# EAGLE design Qwiic_Shield_for_Teensy (EAGLE 9.6.2)
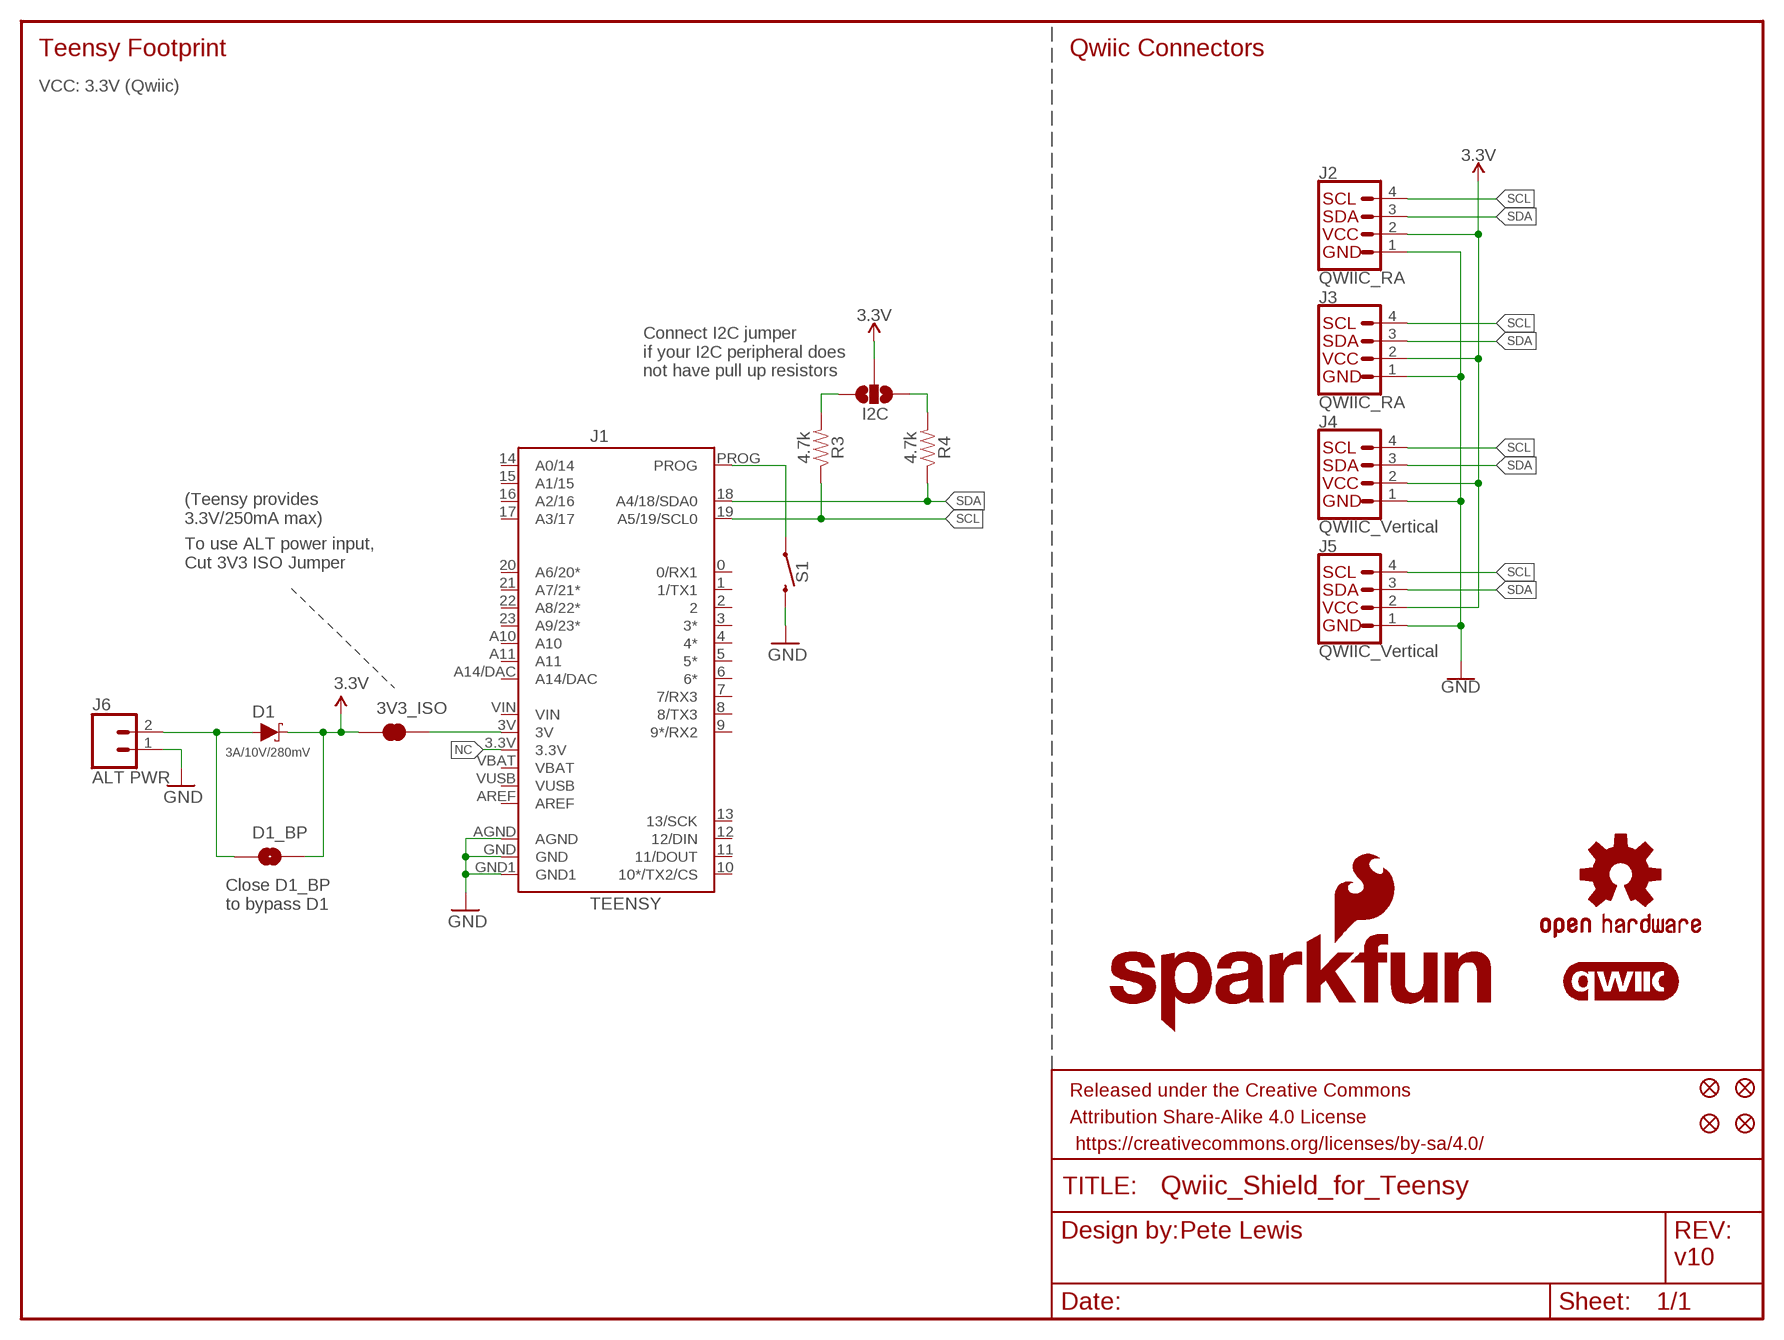
[diagram p0: schematic, sheet 1]

## Parts
3V3_ISO  JUMPER-SMT_2_NC_TRACE_SILK  [SMT-JUMPER_2_NC_TRACE_SILK]
D1  3A/10V/280mV  DIODE-SCHOTTKY-BAT60A  [SOD-323]
D1_BP  JUMPER-SMT_2_NO_SILK  [SMT-JUMPER_2_NO_SILK]
FD1  FIDUCIAL1X2  [FIDUCIAL-1X2]
FD2  FIDUCIAL1X2  [FIDUCIAL-1X2]
FD3  FIDUCIAL1X2  [FIDUCIAL-1X2]
FD4  FIDUCIAL1X2  [FIDUCIAL-1X2]
FRAME1  FRAME-LETTER  [CREATIVE_COMMONS]
I2C  JUMPER-SMT_3_NO_SILK  [SMT-JUMPER_3_NO_SILK]
J1  TEENSY  TEENSYNOSILK  [TEENSY_NOSILK]
J2  QWIIC_RA  QWIIC_CONNECTORJS-1MM  [JST04_1MM_RA]
J3  QWIIC_RA  QWIIC_CONNECTORJS-1MM  [JST04_1MM_RA]
J4  QWIIC_Vertical  QWIIC_CONNECTOR  [JST04_1MM_VERT]
J5  QWIIC_Vertical  QWIIC_CONNECTOR  [JST04_1MM_VERT]
J6  ALT PWR  CONN_021X02_NO_SILK  [1X02_NO_SILK]
LOGO1  SFE_LOGO_NAME_FLAME.1_INCH  [SFE_LOGO_NAME_FLAME_.1]
LOGO2  SFE_LOGO_FLAME.1_INCH  [SFE_LOGO_FLAME_.1]
LOGO3  OSHW-LOGOS  [OSHW-LOGO-S]
LOGO4  QWIIC_LOGO_5MM  [QWIIC_5MM]
R3  4.7k  4.7KOHM-0603-1/10W-1%  [0603]
R4  4.7k  4.7KOHM-0603-1/10W-1%  [0603]
S1  SMD_5.2MM  MOMENTARY-SWITCH-SPST-SMD-5.2MM-TALL  [TACTILE_SWITCH_SMD_5.2MM]

## Nets
3.3V: 3V3_ISO.1 D1.C D1_BP.2 I2C.2 J2.2 J3.2 J4.2 J5.2
GND: J1.AGND J1.GND J1.GND1 J2.1 J3.1 J4.1 J5.1 J6.1 S1.3
N$1: I2C.3 R4.2
N$2: I2C.1 R3.2
N$3: 3V3_ISO.2 J1.3V
N$4: D1.A D1_BP.1 J6.2
N$5: J1.PROG S1.1
NC: J1.3.3V
SCL: J1.19(A5/19/SCL0) J2.4 J3.4 J4.4 J5.4 R3.1
SDA: J1.18(A4/18/SDA0) J2.3 J3.3 J4.3 J5.3 R4.1
Unconnected: J1.0(0/RX1) J1.1(1/TX1) J1.2 J1.3(3*) J1.4(4*) J1.5(5*) J1.6(6*) J1.7(7/RX3) J1.8(8/TX3) J1.9(9*/RX2) J1.10(10*/TX2/CS) J1.11(11/DOUT) J1.12(12/DIN) J1.13(13/SCK) J1.14(A0/14) J1.15(A1/15) J1.16(A2/16) J1.17(A3/17) J1.20(A6/20*) J1.21(A7/21*) J1.22(A8/22*) J1.23(A9/23*) J1.A10 J1.A11 J1.A14/DAC J1.AREF

## Notes on the sheet
- Teensy Footprint | Qwiic Connectors
- VCC: 3.3V (Qwiic)
- Connect I2C jumper 
  if your I2C peripheral does 
  not have pull up resistors
- (Teensy provides 
  3.3V/250mA max)
- To use ALT power input,
  Cut 3V3 ISO Jumper
- Close D1_BP
  to bypass D1
- Pete Lewis
- v10

## Power pins joined to a net without a drawn wire
VBAT: J1.VBAT
VIN: J1.VIN
VUSB: J1.VUSB

## Library data of the parts
3V3_ISO = SparkFun-Jumpers:JUMPER-SMT_2_NC_TRACE: Normally closed trace jumper This jumper has a trace between two pads so it's normally closed (NC). Use a razor knife to open the connection. For best results follow the IPC guidelines for cutting traces: Cutout at least 0.063 mm (0.005 in). Remove all loose material to clean up the cut area. Seal the cut with an approved epoxy. Reapply solder to reclose the connection.
D1 = SparkFun-DiscreteSemi:DIODE-SCHOTTKY: Schottky diode A Schottky diode is a semiconductor diode which has a low forward voltage drop and a very fast switching action.; PROD_ID: DIO-14072
D1_BP = SparkFun-Jumpers:JUMPER-SMT_2_NO: Normally open jumper This jumper has two pads in close proximity to each other. Apply solder to close the connection. Round pads are easier to solder for beginners, but are a lot larger. SparkFun Product that uses the round pads: SparkFun EL Sequencer <https://www.sparkfun.com/products/12781>
FD1-FD4 = SparkFun-Aesthetics:FIDUCIAL: Fiducial Alignment Points Point-of-reference for pick-and-place machines and other optical instruments.
FRAME1 = SparkFun-Aesthetics:FRAME-LETTER: Schematic Frame - Letter Standard 8.5x11 US Letter frame
I2C = SparkFun-Jumpers:JUMPER-SMT_3_NO: Normally open jumper This jumper has three pads in close proximity to each other. Apply solder to close the connection(s).
J1 = SparkFun-Boards:TEENSY: Teensy Footprint Mechanical footprint with connectors for Teensy Development Board with ARM Cortex. SparkFun Products: Teensy 4.0 <https://www.sparkfun.com/products/15583> Teensy 4.0 (with Headers) <https://www.sparkfun.com/products/16997> Teensy 3.2 <https://www.sparkfun.com/products/13736> Teensy LC <https://www.sparkfun.com/products/13305> SparkFun Qwiic Shield for Teensy <https://www.sparkfun.com/products/17119> Teensy Header Kit <https://www.sparkfun.com/products/13925>; SF_ID: DEV-12646
J2 J3 = SparkFun-Connectors:QWIIC_CONNECTOR: SparkFun I2C Standard Qwiic Connector An SMD 1mm pitch JST connector makes it easy and quick (get it? Qwiic?) to connect I2C devices to each other. The Qwiic system <http://www.sparkfun.com/qwiic> enables fast and solderless connection between popular platforms and various sensors and actuators. We carry 200mm <https://www.sparkfun.com/products/14204>, 100mm <https://www.sparkfun.com/products/14205>, 50mm <https://www.sparkfun.com/products/14206>, and breadboard friendly <https://www.sparkfun.com/products/14207> Qwiic cables. We also offer 10 pcs strips <https://www.sparkfun.com/products/14323> the SMD connectors.; PROD_ID: CONN-13694; VALUE: QWIIC_RIGHT_ANGLE
J4 J5 = SparkFun-Connectors:QWIIC_CONNECTOR: SparkFun I2C Standard Qwiic Connector An SMD 1mm pitch JST connector makes it easy and quick (get it? Qwiic?) to connect I2C devices to each other. The Qwiic system <http://www.sparkfun.com/qwiic> enables fast and solderless connection between popular platforms and various sensors and actuators. We carry 200mm <https://www.sparkfun.com/products/14204>, 100mm <https://www.sparkfun.com/products/14205>, 50mm <https://www.sparkfun.com/products/14206>, and breadboard friendly <https://www.sparkfun.com/products/14207> Qwiic cables. We also offer 10 pcs strips <https://www.sparkfun.com/products/14323> the SMD connectors.; PROD_ID: CONN-14483; VALUE: Vertical Qwiic Connector
J6 = SparkFun-Connectors:CONN_02: Multi connection point. Often used as Generic Header-pin footprint for 0.1 inch spaced/style header connections On any of the 0.1 inch spaced packages, you can populate with these: Break Away Headers - Straight <https://www.sparkfun.com/products/116> (PRT-00116) Break Away Male Headers - Right Angle <https://www.sparkfun.com/products/553> (PRT-00553) Female Headers <https://www.sparkfun.com/products/115> (PRT-00115) Break Away Headers - Machine Pin <https://www.sparkfun.com/products/117> (PRT-00117) Break Away Female Headers - Swiss Machine Pin <https://www.sparkfun.com/products/743> (PRT-00743) For SCREWTERMINALS and SPRING TERMINALS visit here: Screw Terimnals on SparkFun.com <https://www.sparkfun.com/search/results?term=Screw+Terminals> (5mm/3.5mm/2.54mm spacing) This device is also useful as a general connection point to wire up your design to another part of your project. Our various solder wires solder well into these plated through hole pads. Hook-Up Wire - Assortment (Stranded, 22 AWG) <https://www.sparkfun.com/products/11375> (PRT-11375) Hook-Up Wire - Assortment (Solid Core, 22 AWG) <https://www.sparkfun.com/products/11367> (PRT-11367) View the entire wire category on our website here <https://www.sparkfun.com/categories/141> Special notes: Molex polarized connector foot print use with: PRT-08233 with associated crimp pins and housings. 2.54_SCREWTERM for use with PRT-10571. 3.5mm Screw Terminal footprints for PRT-08084 5mm Screw Terminal footprints for use with PRT-08432
LOGO1 = SparkFun-Aesthetics:SFE_LOGO_NAME_FLAME: SparkFun Font Logo w/ Flame This is the SparkFun full logo. The logo on the schematic will always be the same size; the package variant is the height of the flame part of the logo. Default layer for the logo on the board is tSilk.
LOGO2 = SparkFun-Aesthetics:SFE_LOGO_FLAME: SparkFun Flame Logo This is the SparkFun flame logo. The logo on the schematic will always be the same size; the package variant is the height of the flame. Default layer for the logo on the board is tSilk.
LOGO3 = SparkFun-Aesthetics:OSHW-LOGO: Open-Source Hardware (OSHW) Logo This logo indicates the piece of hardware it is found on incorporates a OSHW license and/or adheres to the definition of open source hardware found here: http://freedomdefined.org/OSHW
LOGO4 = SparkFun-Aesthetics:QWIIC_LOGO: Qwiic Logos for placement on schematic and PCB. The 5.5mm silk logo is best for placing next to Qwiic connector.
R3 R4 = SparkFun-Resistors:4.7KOHM: 4.7kΩ resistor A resistor is a passive two-terminal electrical component that implements electrical resistance as a circuit element. Resistors act to reduce current flow, and, at the same time, act to lower voltage levels within circuits. - Wikipedia; PROD_ID: RES-07857
S1 = SparkFun-Switches:MOMENTARY-SWITCH-SPST: Momentary Switch (Pushbutton) - SPST Normally-open (NO) SPST momentary switches (buttons, pushbuttons). Variants PTH-12MM - 12mm square, through-hole Momentary Pushbutton Switch - 12mm Square <https://www.sparkfun.com/products/9190> (COM-09190) PTH-6.0MM, PTH-6.0MM-KIT - 6.0mm square, through-hole Mini Pushbutton Switch <https://www.sparkfun.com/products/97> (COM-00097) KIT package intended for soldering kit's - only one side of pads' copper is exposed. PTH-RIGHT-ANGLE-KIT - Right-angle, through-hole Right Angle Tactile Button <https://www.sparkfun.com/products/10791> - Used on SparkFun BigTime Watch Kit <https://www.sparkfun.com/products/11734> SMD-12MM - 12mm square, surface-mount Tactile Button - SMD (12mm) <https://www.sparkfun.com/products/12993> (COM-12993) Used on SparkFun PicoBoard <https://www.sparkfun.com/products/11888> SMD-4.5MM - 4.5mm Square Trackball Switch Used on SparkFun Blackberry Trackballer Breakout <https://www.sparkfun.com/products/13169> SMD-4.6MMX2.8MM - 4.60mm x 2.80mm, surface mount Used on SparkFun SAMD21 Mini Breakout <https://www.sparkfun.com/products/13664> SMD-5.2MM, SMD-5.2-REDUNDANT - 5.2mm square, surface-mount Mini Pushbutton Switch - SMD <https://www.sparkfun.com/products/8720> (COM-08720) Used on Arduino Pro Mini <https://www.sparkfun.com/products/11114> REDUNDANT package connects both switch circuits together SMD-6.0X3.5MM - 6.0 x 3.5mm, surface mount Momentary Reset Switch SMD <https://www.sparkfun.com/products/8229> (COM-08229) SMD-6.2MM-TALL - 6.2mm square, surface mount Tactile Button - SMD (6mm) <https://www.sparkfun.com/products/12992> Used on SparkFun Digital Sandbox <https://www.sparkfun.com/products/12651> SMD-RIGHT-ANGLE - Right-angle, surface mount Used on SparkFun Block for Intel® Edison - Arduino <https://www.sparkfun.com/products/13036>; PROD_ID: SWCH-14139

## Board
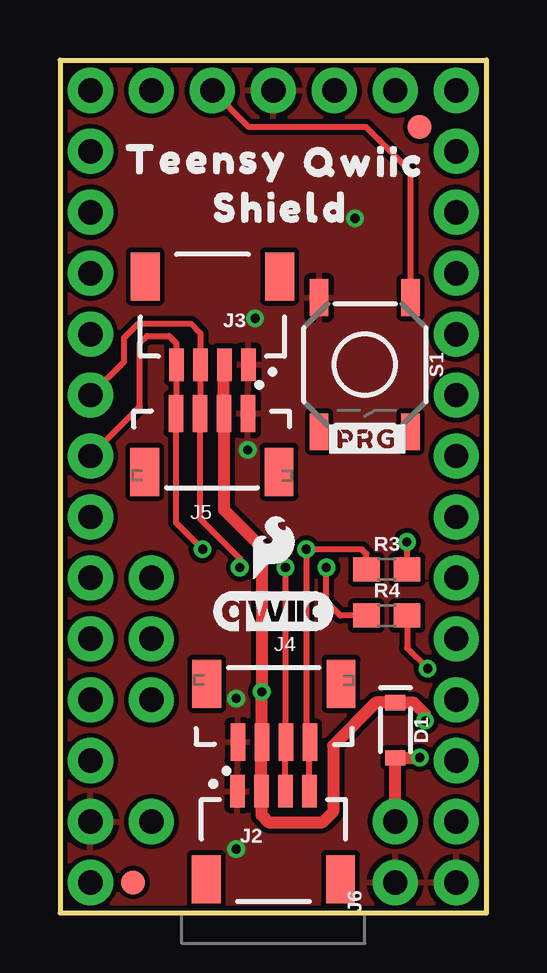
[diagram p1: board, top side]
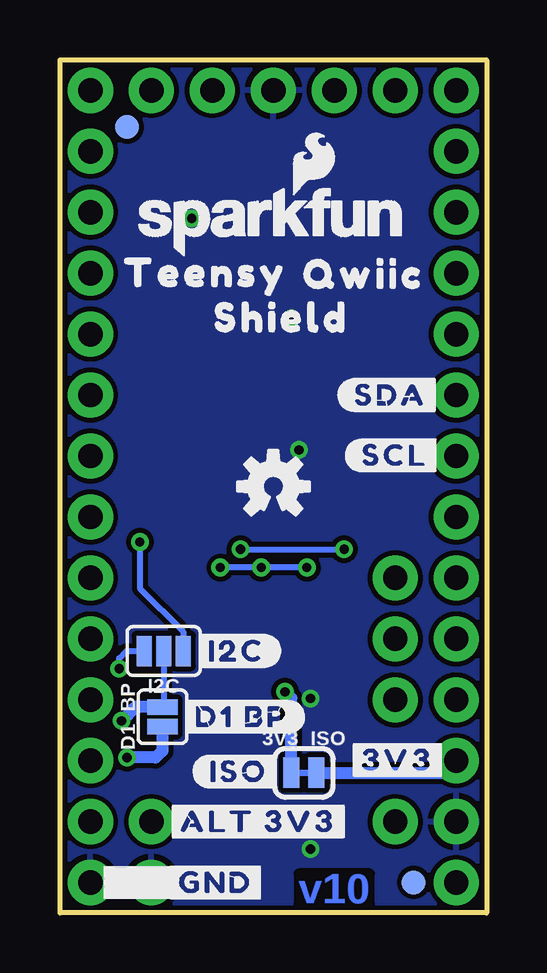
[diagram p2: board, bottom side, seen from below]

Size 17.78 x 35.56 mm. Coordinates in mm from the lower left corner, seen from the top.
Outline: 0,0 17.78,0 17.78,35.56 0,35.56 0,0
Copper layers (1*16): Top 0.035mm / dielectric 1.5mm / Bottom 0.035mm
Design rules "SparkFun-2-layer-TIGHT": minimum track width 7mil, minimum drill 15mil, track to track 7mil, track to pad 7mil, pad to pad 7mil, via to via 7mil, smd to smd 7mil, copper to edge 7mil, drill to drill 7mil, minimum pad ring 7mil, minimum via ring 7mil, stop-mask expansion 4mil, vias tented up to drill 25mil, thermal gap 10mil

### Footprints (pad centres in the part's own frame; a part is rotated, then mirrored left to right if it is on the bottom)
SMT-JUMPER_2_NC_TRACE_SILK = smd 0.66 x 1.27: 1 -0.521,0; 2 0.521,0
SOD-323 = smd 0.63 x 0.83: A 1.15,0; C -1.15,0
SMT-JUMPER_2_NO_SILK = smd 0.635 x 1.27: 1 -0.406,0; 2 0.406,0
FIDUCIAL-1X2 = smd 1 x 1: 1 0,0
SMT-JUMPER_3_NO_SILK = smd 0.635 x 1.27: 1 -0.813,0; 2 0,0; 3 0.813,0
TEENSY_NOSILK = drill 1.016 pad 1.88: 0 7.62,-13.97; 1 7.62,-11.43; 2 7.62,-8.89; 3 7.62,-6.35; 3.3V 2.54,16.51; 3V -7.62,-11.43; 4 7.62,-3.81; 5 7.62,-1.27; 6 7.62,1.27; 7 7.62,3.81; 8 7.62,6.35; 9 7.62,8.89; 10 7.62,11.43; 11 7.62,13.97; 12 7.62,16.51; 13 -7.62,16.51; 14 -7.62,13.97; 15 -7.62,11.43; 16 -7.62,8.89; 17 -7.62,6.35; 18 -7.62,3.81; 19 -7.62,1.27; 20 -7.62,-1.27; 21 -7.62,-3.81; 22 -7.62,-6.35; 23 -7.62,-8.89; A10 -5.08,-6.35; A11 -5.08,-3.81; A14/DAC -5.08,16.51; AGND -7.62,-13.97; AREF -5.08,-8.89; GND 0,16.51; GND1 7.62,-16.51; PROG -2.54,16.51; VBAT 5.08,16.51; VIN -7.62,-16.51; VUSB -5.08,-13.97
JST04_1MM_RA = smd 0.6 x 1.35: 1 -1.5,0; 2 -0.5,0; 3 0.5,0; 4 1.5,0 | smd 1.2 x 2: NC1 2.8,-3.675; NC2 -2.8,-3.675
JST04_1MM_VERT = smd 0.6 x 1.55: 1 -1.478,0.775; 2 -0.478,0.775; 3 0.522,0.775; 4 1.522,0.775 | smd 1.2 x 2: NC1 -2.778,3.2; NC2 2.822,3.2
1X02_NO_SILK = drill 1.016 pad 1.88: 1 0,0; 2 2.54,0
0603 = smd 1.1 x 1: 1 -0.85,0; 2 0.85,0
TACTILE_SWITCH_SMD_5.2MM = smd 1.524 x 0.762: 1 -2.794,1.905; 2 2.794,1.905; 3 -2.794,-1.905; 4 2.794,-1.905

### Placement (x,y rotation side)
3V3_ISO  7.62,5.84 0 bottom
D1  13.97,7.62 270 top
D1_BP  13.51,8.18 90 bottom
FD1  3.05,1.27 0 top
FD2  3.05,1.27 0 bottom
FD3  14.99,32.77 0 top
FD4  14.99,32.77 0 bottom
FRAME1  -12.7,-12.7 0 top  (outside the outline)
I2C  13.46,10.92 180 bottom
J1  8.89,17.78 0 top
J2  8.89,5.08 0 top
J3  6.35,22.86 180 top
J4  8.89,6.35 0 top
J5  6.35,21.59 180 top
J6  13.97,1.27 90 top
LOGO1  8.94,28.83 0 bottom
LOGO2  8.89,15.24 0 top
LOGO3  8.89,17.78 0 bottom
LOGO4  8.86,12.6 0 top
R3  13.61,14.33 0 top
R4  13.61,12.4 0 top
S1  12.7,22.86 270 top
U$1  [#I2C#0]  12.32,10.92 0 bottom
U$2  [TEENSY0]  11.71,26.7 0 bottom
U$3  [3V36]  0,0 0 top
U$4  [#D1_BP#0]  12.85,8.18 0 bottom
U$5  [#ALT_3V3#0]  9.53,3.81 0 bottom
U$6  [#PRG#0]  12.8,19.76 0 top
U$7  [#GND#0]  11.3,1.27 0 bottom
U$8  [SHIELD0]  9.19,29.39 0 top
U$9  [QWIIC0]  12.67,31.29 0 top
U$10  [#ISO#0]  10.34,5.89 0 bottom
U$11  [QWIIC0]  5.13,26.62 0 bottom
U$12  [SHIELD0]  8.56,24.82 0 bottom
U$13  [TEENSY0]  6.15,31.42 0 top
U$15  [#3V3#0]  5.92,6.38 0 bottom
U$18  [#SDA#0]  1.78,21.59 0 bottom
U$19  [#SCL#0]  1.75,19.08 0 bottom

### Tracks (layer width: path | path; a pad name or v marks a point on that pad's centre or on a via)
3.3V  (via drill 0.38)
  Top 0.508: v15.21,8.01 15.21,8.28 14.72,8.77 D1.C 13.16,8.77 11.38,6.99 11.38,4.22 10.95,3.79 8.69,3.79 8.39,4.08 J2.2 8.39,7.1 J4.2 v8.41,9.22 | v8.41,9.22 | J3.2 6.83,22.84 J5.2 6.83,16.82 8.41,15.23 v8.41,9.22
  Bottom 0.254: I2C.2 13.46,8.64 D1_BP.2
  Bottom 0.508: 3V3_ISO.1 8.14,8.95 v8.41,9.22 | D1_BP.2 14.64,8.59 v15.21,8.01
GND  (via drill 0.38)
  other vias: 12.29,28.96 7.82,19.3 7.34,8.94 8.13,24.79 7.34,2.67
  pour Top (isolate 0.203): 0,0 17.78,0 17.78,35.56 0,35.56
  pour Bottom (isolate 0.203): 17.78,0 0,0 0,35.56 17.78,35.56
N$1  (via drill 0.38)
  Top 0.254: R4.2 14.46,11.04 v15.32,10.19
  Bottom 0.254: v15.32,10.19 15.32,10.62 15.01,10.92 I2C.3
N$2  (via drill 0.38)
  Top 0.254: v14.45,15.47 R3.2
  Bottom 0.254: v14.45,15.47 14.45,13.54 12.65,11.73 I2C.1
N$3
  Bottom 0.508: 3V3_ISO.2 1.78,5.84 J1.3V
N$4  (via drill 0.38)
  Top 0.508: J6.2 D1.A 14.98,6.47 v14.99,6.48
  Bottom 0.508: D1_BP.1 13.51,6.76 13.79,6.48 v14.99,6.48
N$5
  Top 0.254: S1.1 14.61,30.91 12.75,32.77 7.87,32.77 J1.PROG
SCL  (via drill 0.38)
  Top 0.254: J2.4 10.39,7.1 J4.4 10.26,7.28 v10.26,15.16 12.57,15.16 12.76,14.97 R3.1 | v5.94,15.16 4.83,16.28 J5.4 4.85,20.84 J3.4 4.85,23.75 4.55,24.05 3.63,24.05 3.33,23.75 3.33,21.11 J1.19
  Bottom 0.254: v10.26,15.16 v5.94,15.16
SDA  (via drill 0.38)
  Top 0.254: J2.3 9.39,7.1 J4.3 9.41,14.39 v9.4,14.4 | J1.18 2.67,22.99 2.67,23.98 3.25,24.56 5.46,24.56 5.85,24.17 J3.3 5.85,20.84 J5.3 5.83,16.45 7.49,14.78 v7.49,14.4 | R4.1 11.68,12.39 11.1,12.98 v11.1,14.4
  Bottom 0.254: v7.49,14.4 v9.4,14.4 v11.1,14.4

### Text on the board
Bottom: v10
tDocu: Pete Lewis